# EAGLE schematic DO module (EAGLE 9.0.1)
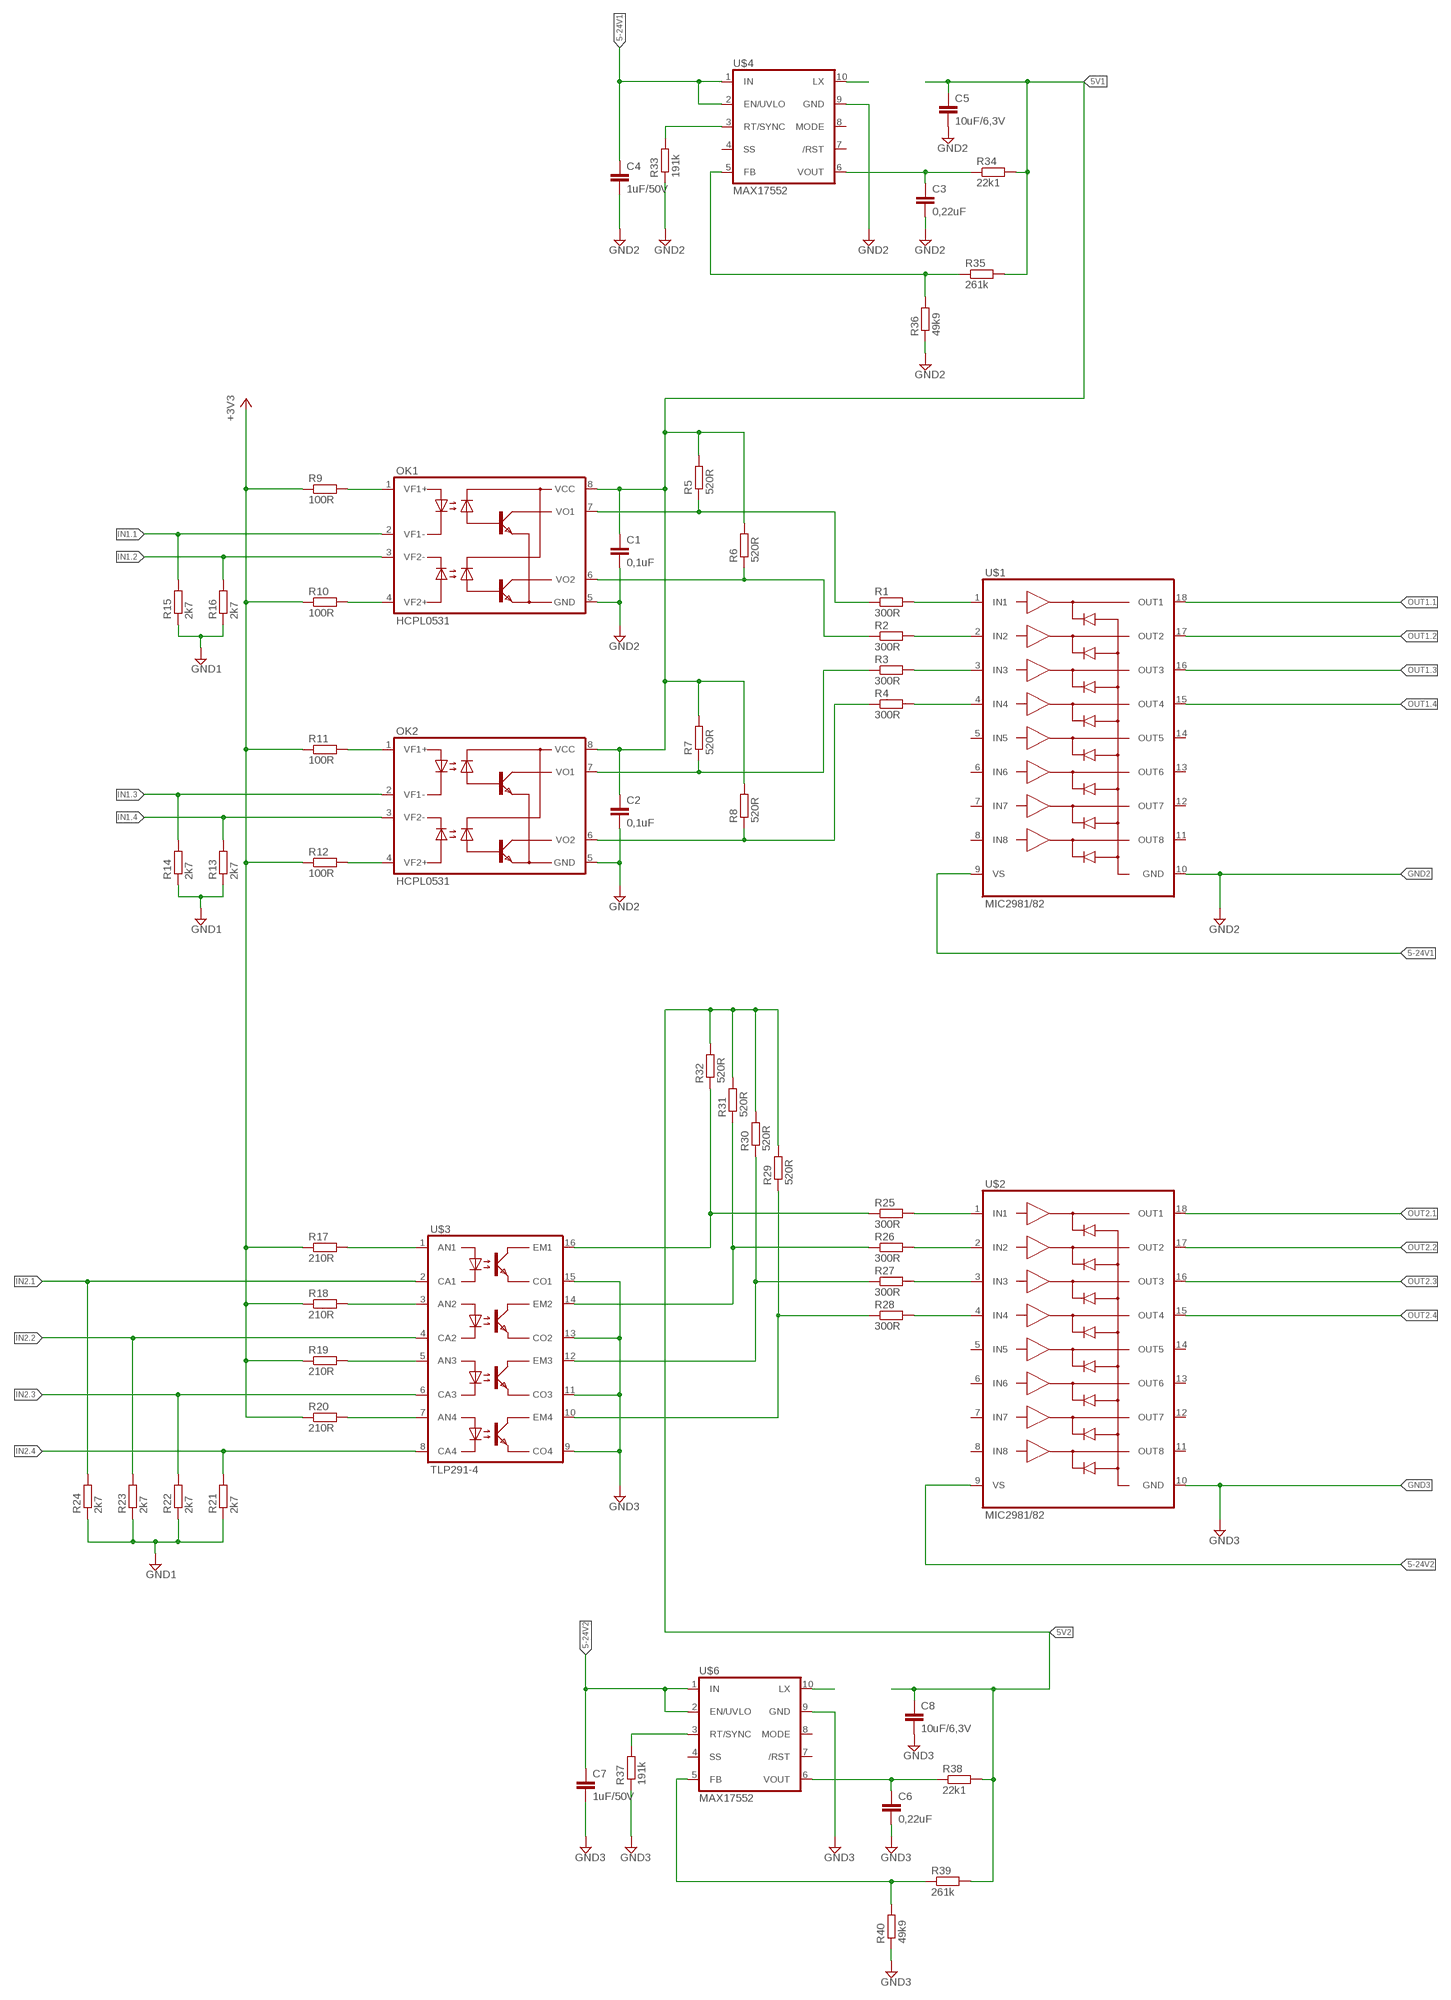
[diagram p0: schematic, sheet 1]

## Parts
C1  0,1uF  C-EUC0603  [C0603]
C2  0,1uF  C-EUC0603  [C0603]
C3  0,22uF  C-EUC0603  [C0603]
C4  1uF/50V  C-EUC1206  [C1206]
C5  10uF/6,3V  C-EUC1206  [C1206]
C6  0,22uF  C-EUC0603  [C0603]
C7  1uF/50V  C-EUC1206  [C1206]
C8  10uF/6,3V  C-EUC1206  [C1206]
OK1  HCPL0531  [SOIC08]
OK2  HCPL0531  [SOIC08]
R1  300R  R-EU_R0603  [R0603]
R2  300R  R-EU_R0603  [R0603]
R3  300R  R-EU_R0603  [R0603]
R4  300R  R-EU_R0603  [R0603]
R5  520R  R-EU_R0603  [R0603]
R6  520R  R-EU_R0603  [R0603]
R7  520R  R-EU_R0603  [R0603]
R8  520R  R-EU_R0603  [R0603]
R9  100R  R-EU_R0603  [R0603]
R10  100R  R-EU_R0603  [R0603]
R11  100R  R-EU_R0603  [R0603]
R12  100R  R-EU_R0603  [R0603]
R13  2k7  R-EU_R0603  [R0603]
R14  2k7  R-EU_R0603  [R0603]
R15  2k7  R-EU_R0603  [R0603]
R16  2k7  R-EU_R0603  [R0603]
R17  210R  R-EU_R0603  [R0603]
R18  210R  R-EU_R0603  [R0603]
R19  210R  R-EU_R0603  [R0603]
R20  210R  R-EU_R0603  [R0603]
R21  2k7  R-EU_R0603  [R0603]
R22  2k7  R-EU_R0603  [R0603]
R23  2k7  R-EU_R0603  [R0603]
R24  2k7  R-EU_R0603  [R0603]
R25  300R  R-EU_R0603  [R0603]
R26  300R  R-EU_R0603  [R0603]
R27  300R  R-EU_R0603  [R0603]
R28  300R  R-EU_R0603  [R0603]
R29  520R  R-EU_R0603  [R0603]
R30  520R  R-EU_R0603  [R0603]
R31  520R  R-EU_R0603  [R0603]
R32  520R  R-EU_R0603  [R0603]
R33  191k  R-EU_R0603  [R0603]
R34  22k1  R-EU_R0603  [R0603]
R35  261k  R-EU_R0603  [R0603]
R36  49k9  R-EU_R0603  [R0603]
R37  191k  R-EU_R0603  [R0603]
R38  22k1  R-EU_R0603  [R0603]
R39  261k  R-EU_R0603  [R0603]
R40  49k9  R-EU_R0603  [R0603]
U$1  MIC2981/82  [SOP18]
U$2  MIC2981/82  [SOP18]
U$3  TLP291-4  [SO16]
U$4  MAX17552  [TSSOP-10(10UMAX)]
U$6  MAX17552  [TSSOP-10(10UMAX)]

## Nets
5-24V1: C4.1 U$1.9(VS) U$4.1(IN) U$4.2(EN/UVLO)
5-24V2: C7.1 U$2.9(VS) U$6.1(IN) U$6.2(EN/UVLO)
5V1: C1.1 C2.1 C5.1 OK1.8(VCC) OK2.8(VCC) R5.2 R6.2 R7.2 R8.2 R34.2 R35.2
5V2: C8.1 R29.2 R30.2 R31.2 R32.2 R38.2 R39.2
+3V3: R9.1 R10.1 R11.1 R12.1 R17.1 R18.1 R19.1 R20.1
GND1: R13.1 R14.1 R15.1 R16.1 R21.1 R22.1 R23.1 R24.1
GND2: C1.2 C2.2 C3.2 C4.2 C5.2 OK1.5(GND) OK2.5(GND) R33.1 R36.1 U$1.10(GND) U$4.9(GND)
GND3: C6.2 C7.2 C8.2 R37.1 R40.1 U$2.10(GND) U$3.9(CO4) U$3.11(CO3) U$3.13(CO2) U$3.15(CO1) U$6.9(GND)
IN1.1: OK1.2(VF1-) R15.2
IN1.2: OK1.3(VF2-) R16.2
IN1.3: OK2.2(VF1-) R14.2
IN1.4: OK2.3(VF2-) R13.2
IN2.1: R24.2 U$3.2(CA1)
IN2.2: R23.2 U$3.4(CA2)
IN2.3: R22.2 U$3.6(CA3)
IN2.4: R21.2 U$3.8(CA4)
N$2: OK1.7(VO1) R1.1 R5.1
N$3: R1.2 U$1.1(IN1)
N$4: OK1.1(VF1+) R9.2
N$5: OK1.6(VO2) R2.1 R6.1
N$6: OK1.4(VF2+) R10.2
N$7: R17.2 U$3.1(AN1)
N$8: OK2.7(VO1) R3.1 R7.1
N$9: R18.2 U$3.3(AN2)
N$10: OK2.1(VF1+) R11.2
N$11: OK2.6(VO2) R4.1 R8.1
N$12: R19.2 U$3.5(AN3)
N$13: R2.2 U$1.2(IN2)
N$14: R3.2 U$1.3(IN3)
N$15: R4.2 U$1.4(IN4)
N$16: R20.2 U$3.7(AN4)
N$17: OK2.4(VF2+) R12.2
N$18: R27.1 R30.1 U$3.12(EM3)
N$19: R25.1 R32.1 U$3.16(EM1)
N$20: R25.2 U$2.1(IN1)
N$21: R26.2 U$2.2(IN2)
N$22: R27.2 U$2.3(IN3)
N$23: R28.2 U$2.4(IN4)
N$24: R26.1 R31.1 U$3.14(EM2)
N$25: R28.1 R29.1 U$3.10(EM4)
N$27: U$4.10(LX)
N$29: R33.2 U$4.3(RT/SYNC)
N$30: C3.1 R34.1 U$4.6(VOUT)
N$31: R37.2 U$6.3(RT/SYNC)
N$32: R35.1 R36.2 U$4.5(FB)
N$33: U$6.10(LX)
N$34: R39.1 R40.2 U$6.5(FB)
N$36: C6.1 R38.1 U$6.6(VOUT)
OUT1.1: U$1.18(OUT1)
OUT1.2: U$1.17(OUT2)
OUT1.3: U$1.16(OUT3)
OUT1.4: U$1.15(OUT4)
OUT2.1: U$2.18(OUT1)
OUT2.2: U$2.17(OUT2)
OUT2.3: U$2.16(OUT3)
OUT2.4: U$2.15(OUT4)
Unconnected: U$1.5(IN5) U$1.6(IN6) U$1.7(IN7) U$1.8(IN8) U$1.11(OUT8) U$1.12(OUT7) U$1.13(OUT6) U$1.14(OUT5) U$2.5(IN5) U$2.6(IN6) U$2.7(IN7) U$2.8(IN8) U$2.11(OUT8) U$2.12(OUT7) U$2.13(OUT6) U$2.14(OUT5) U$4.4(SS) U$4.7(/RST) U$4.8(MODE) U$6.4(SS) U$6.7(/RST) U$6.8(MODE)

## Library data of the parts
C1-C8 = rcl:C-EU: CAPACITOR, European symbol; SPICEPREFIX: C
OK1 OK2 = fx_workspace:HCPL0531: HEWLETT PACKARD OPTO COUPLER
R1-R40 = rcl:R-EU_: RESISTOR, European symbol; SPICEPREFIX: R
U$1 U$2 = fx_workspace:MIC2981/82
U$3 = fx_workspace:TLP291-4
U$4 U$6 = fx_workspace:MAX17552